# Altium schematic sheet bno085.schdoc
size 217 x 118 mm
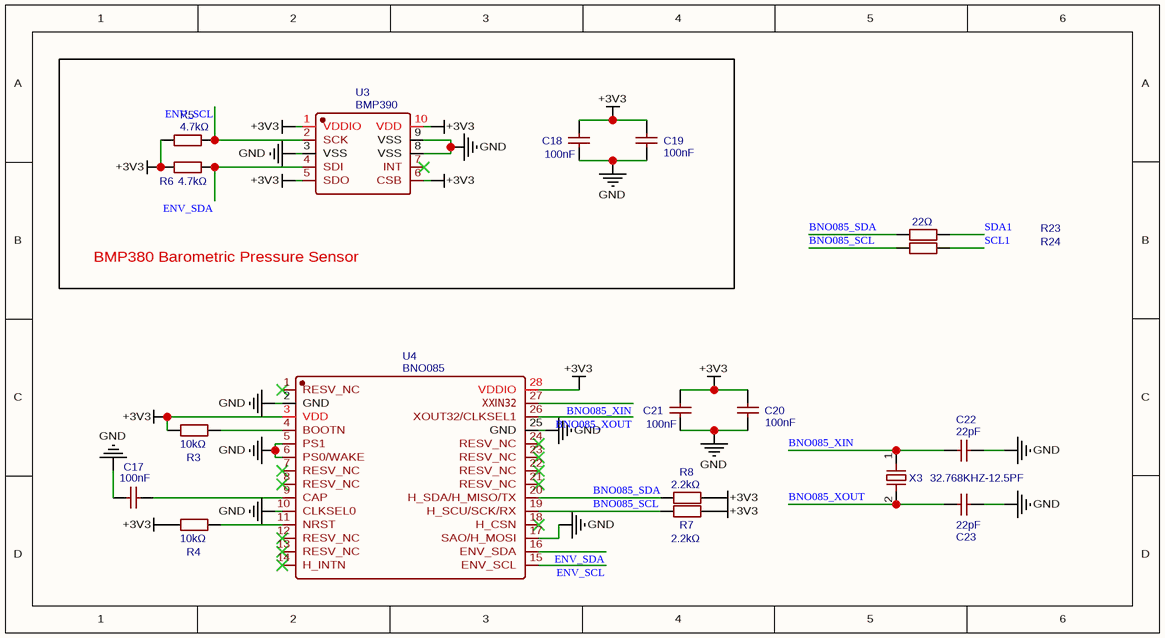
[diagram p0: bno085.schdoc]

## Parts
C17  100nF  [C0402]
C18  100nF  [C0402]
C19  100nF  [C0402]
C20  100nF  [C0402]
C21  100nF  [C0402]
C22  22pF  [C0402]
C23  22pF  [C0402]
R3  10kΩ  [R0402]
R4  10kΩ  [R0402]
R5  4.7kΩ  [R0402]
R6  4.7kΩ  [R0402]
R7  2.2kΩ  [R0402]
R8  2.2kΩ  [R0402]
R23  22Ω  [R0402]
R24  22Ω  [R0402]  (value not drawn)
U3  BMP390  [LGA-10_L2.0-W2.0-P0.50-BL]
U4  BNO085  [LGA-28_L5.2-W3.8-P0.50-BL-1]
X3  32.768KHZ-12.5PF  [CRYSTAL-SMD_L3.2-W1.5-1]

## Blocks framed on the sheet
BMP380 Barometric Pressure Sensor: C18 C19 R5 R6 U3

## Nets
+3V3: C18.2 C19.2 C20.2 C21.2 R3.1 R4.1 R5.1 R6.1 R7.2 R8.2 U3.1(VDDIO) U3.5(SDO) U3.6(CSB) U3.10(VDD) U4.3(VDD) U4.28(VDDIO)
GND: C17.1 C18.1 C19.1 C20.1 C21.1 C22.2 C23.2 U3.3(VSS) U3.8(VSS) U3.9(VSS) U4.2(GND) U4.5(PS1) U4.6(PS0/WAKE) U4.10(CLKSEL0) U4.17(SAO/H_MOSI) U4.25(GND)
BNO085_SCL: R7.1 R24.1 U4.19(H_SCU/SCK/RX)
BNO085_SDA: R8.1 R23.1 U4.20(H_SDA/H_MISO/TX)
BNO085_XIN: C22.1 U4.27(XⅪN32) X3.1
BNO085_XOUT: C23.1 U4.26(XOUT32/CLKSEL1) X3.2
ENV_SCL: R5.2 U3.2(SCK) U4.15(ENV_SCL)
ENV_SDA: R6.2 U3.4(SDI) U4.16(ENV_SDA)
SCL1: R24.2
SDA1: R23.2
NetC17_2: C17.2 U4.9(CAP)
NetR3_2: R3.2 U4.4(BOOTN)
NetR4_2: R4.2 U4.11(NRST)

Not connected (* = marked no-connect by the designer): U3 7(INT)*; U4 1(RESV_NC)* 7(RESV_NC)* 8(RESV_NC)* 12(RESV_NC)* 13(RESV_NC)* 14(H_INTN)* 18(H_CSN)* 21(RESV_NC)* 22(RESV_NC)* 23(RESV_NC)* 24(RESV_NC)*

## Library data of the parts
C17-C21 = 100nF: Manufacturer Part: CL05B104KO5NNNC; Manufacturer: SAMSUNG(三星); nameAlias: Value; Supplier: LCSC; Supplier Part: C1525; JLCPCB Part Class: Basic Part; spicePre: C; spiceSymbolName: CL05B104KO5NNNC
C22 C23 = 22pF: Manufacturer: FH(风华); Manufacturer Part: 0402CG220J500NT; nameAlias: Value; Supplier: LCSC; Supplier Part: C1555; JLCPCB Part Class: Basic Part; spicePre: C; spiceSymbolName: 0402CG220J500NT
R3 R4 = 10kΩ: Manufacturer: UNI-ROYAL(厚声); Manufacturer Part: 0402WGF1002TCE; nameAlias: Value; Supplier: LCSC; Supplier Part: C25744; JLCPCB Part Class: Basic Part; spicePre: R; spiceSymbolName: 0402WGF1002TCE
R5 R6 = 4.7kΩ: Manufacturer: UNI-ROYAL(厚声); Manufacturer Part: 0402WGF4701TCE; nameAlias: Value; Supplier: LCSC; Supplier Part: C25900; JLCPCB Part Class: Basic Part; spicePre: R; spiceSymbolName: 0402WGF4701TCE
R7 R8 = 2.2kΩ: Manufacturer: UNI-ROYAL(厚声); Manufacturer Part: 0402WGF2201TCE; nameAlias: Value; Supplier: LCSC; Supplier Part: C25879; JLCPCB Part Class: Basic Part; spicePre: R; spiceSymbolName: 0402WGF2201TCE
R23 R24 = 22Ω: Manufacturer: UNI-ROYAL(厚声); Manufacturer Part: 0402WGF220JTCE; nameAlias: Value; Supplier: LCSC; Supplier Part: C25092; JLCPCB Part Class: Basic Part; spicePre: R; spiceSymbolName: 0402WGF220JTCE
U3 = BMP390: Manufacturer: null; Contributor: lcsc; Supplier: LCSC; Supplier Part: C9900016584; Manufacturer Part: BMP390; JLCPCB Part Class: Extended Part; spicePre: U; spiceSymbolName: BMP390
U4 = BNO085: Manufacturer: null; Contributor: lcsc; Supplier: LCSC; Supplier Part: C9900000640; Manufacturer Part: BNO085; JLCPCB Part Class: Extended Part; spicePre: U; spiceSymbolName: BNO085
X3 = 32.768KHZ-12.5PF: Manufacturer: null; Manufacturer Part: CMTV-T1A-32.768K-12.5PF-20PPM; Contributor: lcsc; Supplier: LCSC; Supplier Part: C9900013504; JLCPCB Part Class: Extended Part; spicePre: X; spiceSymbolName: CMTV-T1A-32.768K-12.5PF-20PPM